# Altium schematic sheet UCD3138 Demo Board.SchDoc: 模板
size A4; Author: Sunduoze; CompanyName: https://sunze.xyz/; Organization: Enze Co.; Revision: V1.0
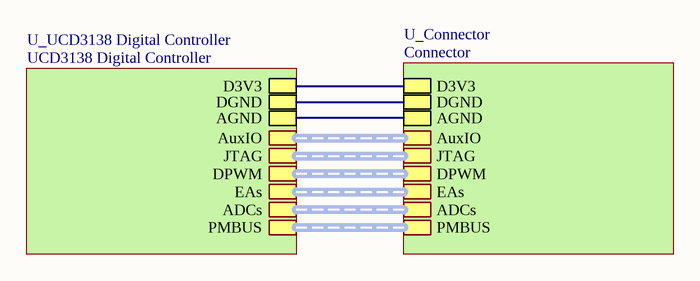
[diagram p0: UCD3138 Demo Board.SchDoc]

## Sub-sheets
U_Connector = Connector: DGND, AGND, D3V3, ADCs (harness ADCx14), DPWM (harness DPWM), EAs (harness EA), AuxIO (harness AuxIO), JTAG (harness Debug), PMBUS (harness JTAG)
U_UCD3138 Digital Controller = UCD3138 Digital Controller: JTAG (harness Debug), DGND, ADCs (harness ADCx14), DPWM (harness DPWM), PMBUS (harness JTAG), EAs (harness EA), AGND, AuxIO (harness AuxIO), D3V3

## Nets
(unnamed): sheet U_UCD3138 Digital Controller/DGND, sheet U_Connector/DGND
(unnamed): sheet U_UCD3138 Digital Controller/AGND, sheet U_Connector/AGND
(unnamed): sheet U_UCD3138 Digital Controller/D3V3, sheet U_Connector/D3V3

## Buses and harness runs
harness sheet U_Connector/ADCs = sheet U_UCD3138 Digital Controller/ADCs
harness sheet U_Connector/AuxIO = sheet U_UCD3138 Digital Controller/AuxIO
harness sheet U_Connector/DPWM = sheet U_UCD3138 Digital Controller/DPWM
harness sheet U_Connector/EAs = sheet U_UCD3138 Digital Controller/EAs
harness sheet U_Connector/JTAG = sheet U_UCD3138 Digital Controller/JTAG
harness sheet U_Connector/PMBUS = sheet U_UCD3138 Digital Controller/PMBUS

## Notes on the sheet
- 标题:
- 图纸:
- A4
- 作者:
- 日期:
- 版本:
- 主页:
- Enze